# Altium schematic sheet Bargraph_64.SchDoc
size A4 portrait
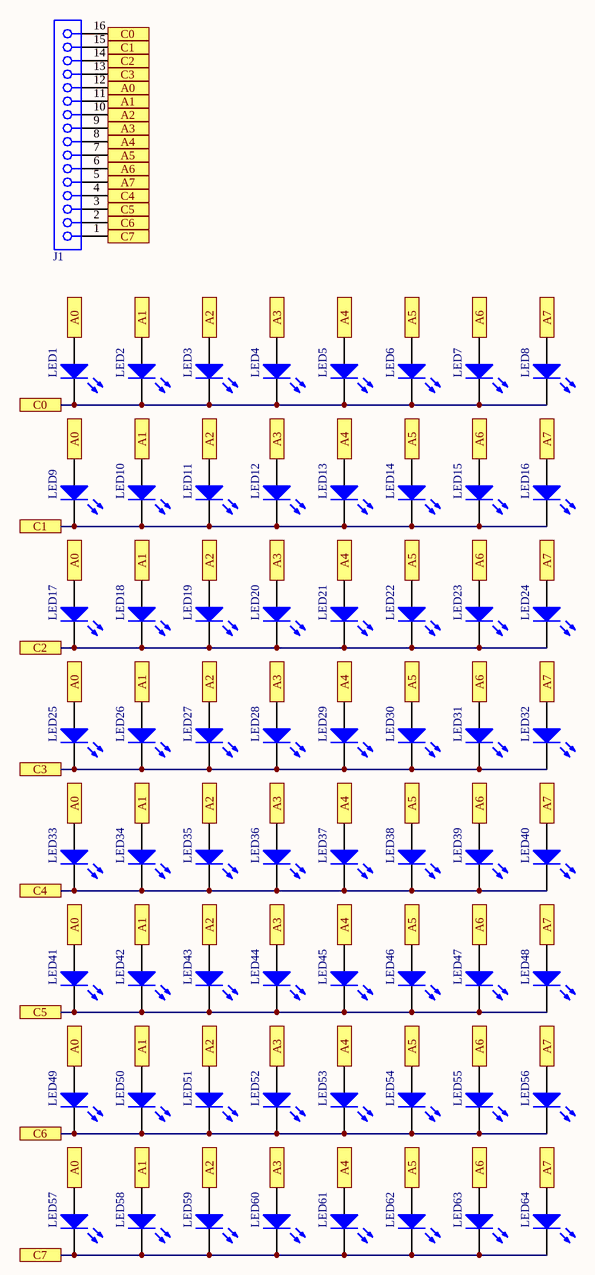
[diagram p0: Bargraph_64.SchDoc]

## Parts
J1  16pin  [16pos_127]  (value not drawn)
LED1  150060GS75000  [0603_A]  (value not drawn)
LED2  150060GS75000  [0603_A]  (value not drawn)
LED3  150060GS75000  [0603_A]  (value not drawn)
LED4  150060GS75000  [0603_A]  (value not drawn)
LED5  150060GS75000  [0603_A]  (value not drawn)
LED6  150060GS75000  [0603_A]  (value not drawn)
LED7  150060GS75000  [0603_A]  (value not drawn)
LED8  150060GS75000  [0603_A]  (value not drawn)
LED9  150060GS75000  [0603_A]  (value not drawn)
LED10  150060GS75000  [0603_A]  (value not drawn)
LED11  150060GS75000  [0603_A]  (value not drawn)
LED12  150060GS75000  [0603_A]  (value not drawn)
LED13  150060GS75000  [0603_A]  (value not drawn)
LED14  150060GS75000  [0603_A]  (value not drawn)
LED15  150060GS75000  [0603_A]  (value not drawn)
LED16  150060GS75000  [0603_A]  (value not drawn)
LED17  150060GS75000  [0603_A]  (value not drawn)
LED18  150060GS75000  [0603_A]  (value not drawn)
LED19  150060GS75000  [0603_A]  (value not drawn)
LED20  150060GS75000  [0603_A]  (value not drawn)
LED21  150060GS75000  [0603_A]  (value not drawn)
LED22  150060GS75000  [0603_A]  (value not drawn)
LED23  150060GS75000  [0603_A]  (value not drawn)
LED24  150060GS75000  [0603_A]  (value not drawn)
LED25  150060GS75000  [0603_A]  (value not drawn)
LED26  150060GS75000  [0603_A]  (value not drawn)
LED27  150060GS75000  [0603_A]  (value not drawn)
LED28  150060GS75000  [0603_A]  (value not drawn)
LED29  150060GS75000  [0603_A]  (value not drawn)
LED30  150060GS75000  [0603_A]  (value not drawn)
LED31  150060GS75000  [0603_A]  (value not drawn)
LED32  150060GS75000  [0603_A]  (value not drawn)
LED33  150060GS75000  [0603_A]  (value not drawn)
LED34  150060GS75000  [0603_A]  (value not drawn)
LED35  150060GS75000  [0603_A]  (value not drawn)
LED36  150060GS75000  [0603_A]  (value not drawn)
LED37  150060GS75000  [0603_A]  (value not drawn)
LED38  150060GS75000  [0603_A]  (value not drawn)
LED39  150060GS75000  [0603_A]  (value not drawn)
LED40  150060GS75000  [0603_A]  (value not drawn)
LED41  150060GS75000  [0603_A]  (value not drawn)
LED42  150060GS75000  [0603_A]  (value not drawn)
LED43  150060GS75000  [0603_A]  (value not drawn)
LED44  150060GS75000  [0603_A]  (value not drawn)
LED45  150060GS75000  [0603_A]  (value not drawn)
LED46  150060GS75000  [0603_A]  (value not drawn)
LED47  150060GS75000  [0603_A]  (value not drawn)
LED48  150060GS75000  [0603_A]  (value not drawn)
LED49  150060GS75000  [0603_A]  (value not drawn)
LED50  150060GS75000  [0603_A]  (value not drawn)
LED51  150060GS75000  [0603_A]  (value not drawn)
LED52  150060GS75000  [0603_A]  (value not drawn)
LED53  150060GS75000  [0603_A]  (value not drawn)
LED54  150060GS75000  [0603_A]  (value not drawn)
LED55  150060GS75000  [0603_A]  (value not drawn)
LED56  150060GS75000  [0603_A]  (value not drawn)
LED57  150060GS75000  [0603_A]  (value not drawn)
LED58  150060GS75000  [0603_A]  (value not drawn)
LED59  150060GS75000  [0603_A]  (value not drawn)
LED60  150060GS75000  [0603_A]  (value not drawn)
LED61  150060GS75000  [0603_A]  (value not drawn)
LED62  150060GS75000  [0603_A]  (value not drawn)
LED63  150060GS75000  [0603_A]  (value not drawn)
LED64  150060GS75000  [0603_A]  (value not drawn)

## Ports
A0, A1, A2, A3, A4, A5, A6, A7, C0, C1, C2, C3, C4, C5, C6, C7

## Nets
A0: J1.12 LED1.2(A) LED9.2(A) LED17.2(A) LED25.2(A) LED33.2(A) LED41.2(A) LED49.2(A) LED57.2(A) ; port A0
A1: J1.11 LED2.2(A) LED10.2(A) LED18.2(A) LED26.2(A) LED34.2(A) LED42.2(A) LED50.2(A) LED58.2(A) ; port A1
A2: J1.10 LED3.2(A) LED11.2(A) LED19.2(A) LED27.2(A) LED35.2(A) LED43.2(A) LED51.2(A) LED59.2(A) ; port A2
A3: J1.9 LED4.2(A) LED12.2(A) LED20.2(A) LED28.2(A) LED36.2(A) LED44.2(A) LED52.2(A) LED60.2(A) ; port A3
A4: J1.8 LED5.2(A) LED13.2(A) LED21.2(A) LED29.2(A) LED37.2(A) LED45.2(A) LED53.2(A) LED61.2(A) ; port A4
A5: J1.7 LED6.2(A) LED14.2(A) LED22.2(A) LED30.2(A) LED38.2(A) LED46.2(A) LED54.2(A) LED62.2(A) ; port A5
A6: J1.6 LED7.2(A) LED15.2(A) LED23.2(A) LED31.2(A) LED39.2(A) LED47.2(A) LED55.2(A) LED63.2(A) ; port A6
A7: J1.5 LED8.2(A) LED16.2(A) LED24.2(A) LED32.2(A) LED40.2(A) LED48.2(A) LED56.2(A) LED64.2(A) ; port A7
C0: J1.16 LED1.1(K) LED2.1(K) LED3.1(K) LED4.1(K) LED5.1(K) LED6.1(K) LED7.1(K) LED8.1(K) ; port C0
C1: J1.15 LED9.1(K) LED10.1(K) LED11.1(K) LED12.1(K) LED13.1(K) LED14.1(K) LED15.1(K) LED16.1(K) ; port C1
C2: J1.14 LED17.1(K) LED18.1(K) LED19.1(K) LED20.1(K) LED21.1(K) LED22.1(K) LED23.1(K) LED24.1(K) ; port C2
C3: J1.13 LED25.1(K) LED26.1(K) LED27.1(K) LED28.1(K) LED29.1(K) LED30.1(K) LED31.1(K) LED32.1(K) ; port C3
C4: J1.4 LED33.1(K) LED34.1(K) LED35.1(K) LED36.1(K) LED37.1(K) LED38.1(K) LED39.1(K) LED40.1(K) ; port C4
C5: J1.3 LED41.1(K) LED42.1(K) LED43.1(K) LED44.1(K) LED45.1(K) LED46.1(K) LED47.1(K) LED48.1(K) ; port C5
C6: J1.2 LED49.1(K) LED50.1(K) LED51.1(K) LED52.1(K) LED53.1(K) LED54.1(K) LED55.1(K) LED56.1(K) ; port C6
C7: J1.1 LED57.1(K) LED58.1(K) LED59.1(K) LED60.1(K) LED61.1(K) LED62.1(K) LED63.1(K) LED64.1(K) ; port C7

## Library data of the parts
J1 = 16pin: SQ Post Socket, Through-hole, Vertical, -55 to 125 degC, 1.,27 mm Pitch, 16-Pin, male, RoHS; PartNumber: SSW-116-02-G-S; Manufacturer: Samtec; Pitch: 2.54 mm; ComponentLink2URL: http://www.samtec.com/documents/webfiles/pdf/SSW_TH.PDF; Mounting Technology: Through-hole; ComponentLink1URL: http://www.samtec.com; ComponentLink3Description: Package Specification; Orientation: Vertical; PackageVersion: CA, 6/1987; Temperature Range: -55 to 125 degC; ComponentLink2Description: Datasheet; PackageDescription: Assembly, Socket Strip .016 X .031 Tail; DatasheetVersion: F-214; ComponentLink1Description: Manufacturer URL; ComponentLink3URL: http://www.samtec.com/documents/webfiles/cpdf/SSW-1XX-XX-XXX-X-XX-XXX-XX-MKT.pdf; PackageReference: SSW-116-02-X-S; RoHS: True
LED1-LED64 = CMP-1426-00002-1: SMD mono-color Chip LED, WL-SMCW, Green; Manufacturer: Wuerth Elektronik; ComponentLink1URL: http://www.we-online.com; ComponentLink2Description: Datasheet; Color: Green; ComponentLink2URL: http://katalog.we-online.com/led/datasheet/150060GS75000.pdf; PartNumber: 150060GS75000; PackageReference: 0603_A; ComponentLink1Description: Manufacturer URL